# EAGLE design W033C (EAGLE 6.6.0)
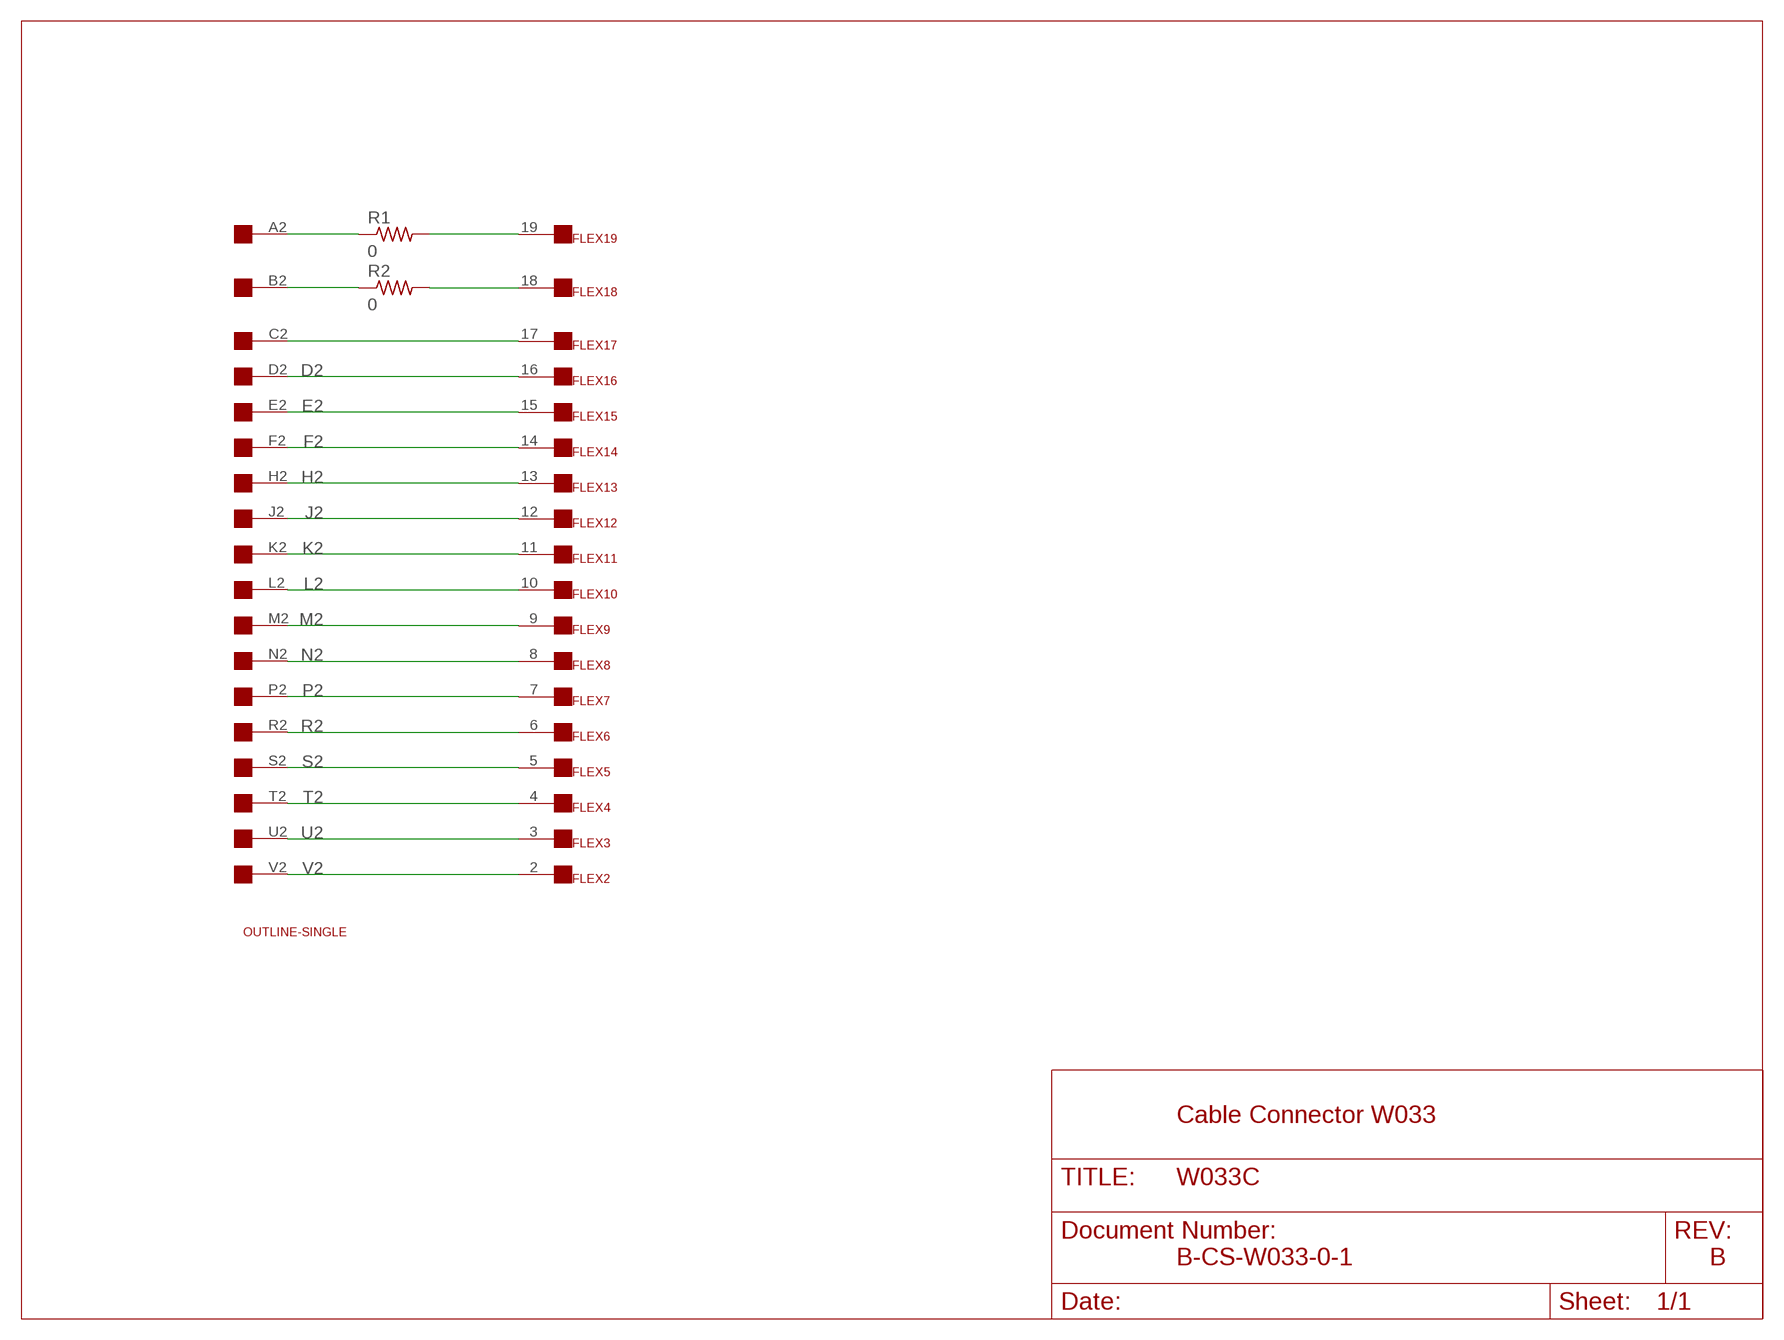
[diagram p0: schematic, sheet 1]

## Parts
FLEX  FLEX19  [FLEX19]
R1  0  R-US_0207/10  [0207/10]
R2  0  R-US_0207/10  [0207/10]
U$1  OUTLINE-SINGLE  [SINGLE]
U$2  EDGE-1  [EDGE-CON1]

## Nets
B2: R2.1 U$2.B2
D2: FLEX.16 U$2.D2
E2: FLEX.15 U$2.E2
F2: FLEX.14 U$2.F2
H2: FLEX.13 U$2.H2
J2: FLEX.12 U$2.J2
K2: FLEX.11 U$2.K2
L2: FLEX.10 U$2.L2
M2: FLEX.9 U$2.M2
N2: FLEX.8 U$2.N2
N$1: FLEX.17 U$2.C2
N$2: R1.1 U$2.A2
N$3: FLEX.19 R1.2
N$4: FLEX.18 R2.2
P2: FLEX.7 U$2.P2
R2: FLEX.6 U$2.R2
S2: FLEX.5 U$2.S2
T2: FLEX.4 U$2.T2
U2: FLEX.3 U$2.U2
V2: FLEX.2 U$2.V2
Unconnected: FLEX.1

## Notes on the sheet
- Cable Connector W033
- B-CS-W033-0-1 | B

## Library data of the parts
FLEX = dec-con:FLEX19: 19 pin Flexprint Connection
R1 R2 = rcl:R-US_: RESISTOR, American symbol
U$1 = dec-con:OUTLINE-*: Board outlines for DEC boards.
U$2 = dec-con:EDGE-1: Single-Sided DEC Edge Connector -- (side 2)

## Net classes
0 default: width 0.813 mm

## Board
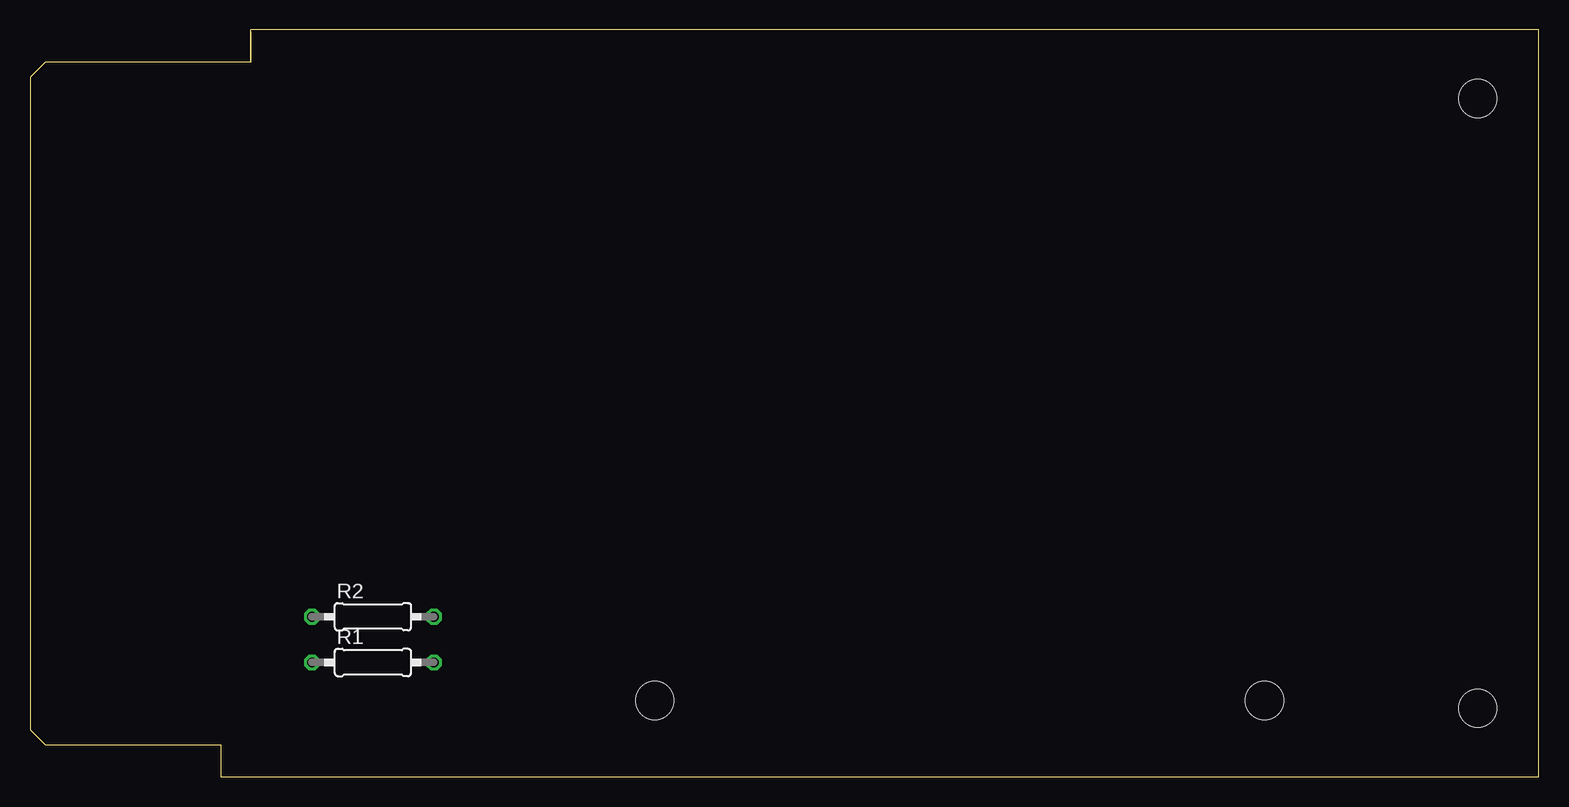
[diagram p1: board, top side]
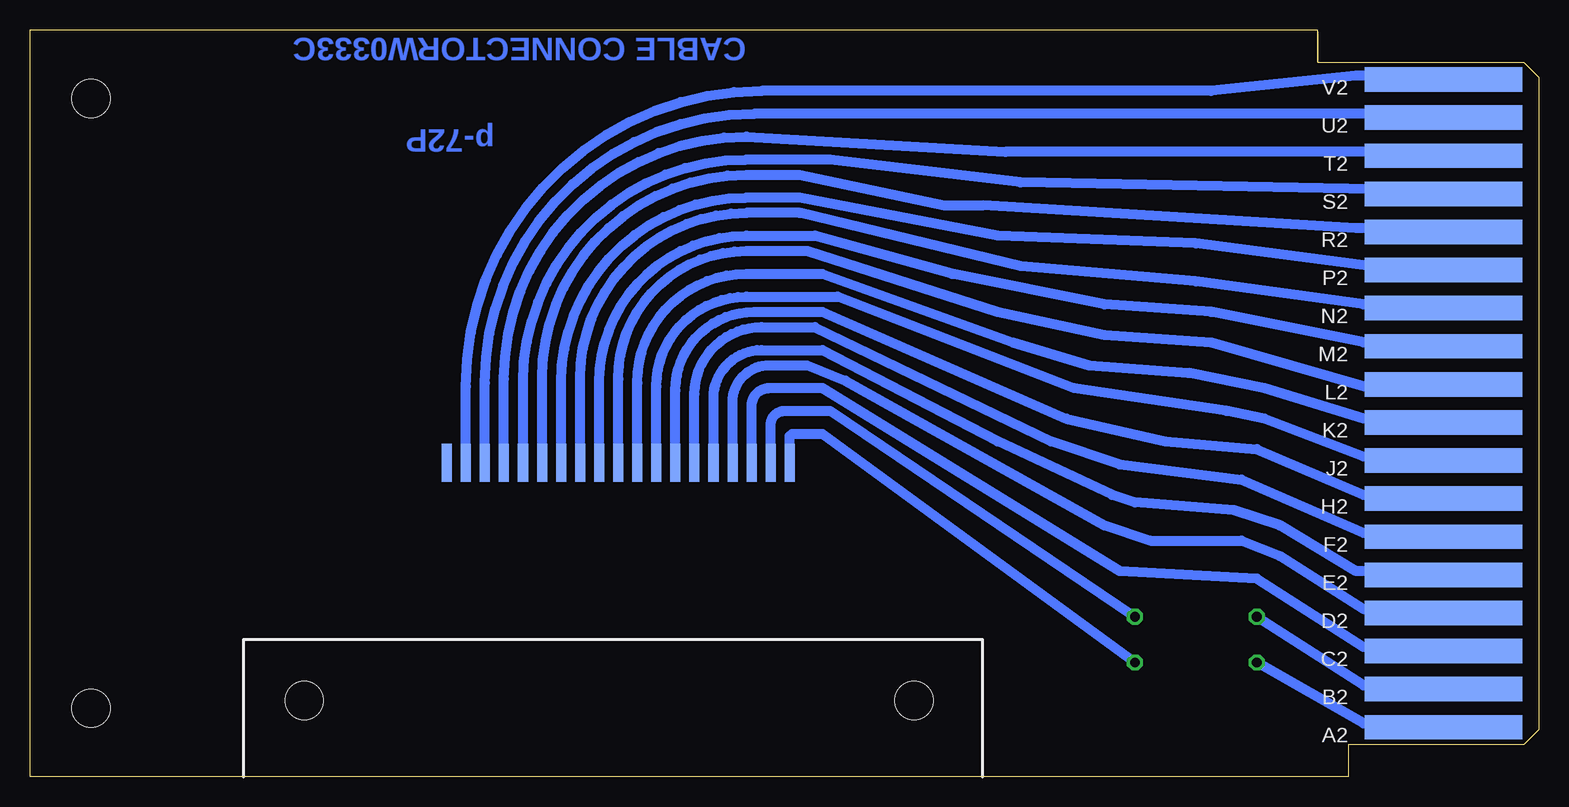
[diagram p2: board, bottom side, seen from below]

Size 125.73 x 62.23 mm. Coordinates in mm from the lower left corner, seen from the top.
Copper layers (1+16): Top 0.035mm / dielectric 1.5mm / Bottom 0.035mm
Design rules "16mils": minimum track width 16mil, minimum drill 32mil, track to track 15mil, track to pad 10mil, pad to pad 10mil, via to via 10mil, smd to smd 10mil, copper to edge 13mil, drill to drill 10mil, minimum pad ring 10mil, minimum via ring 8mil, stop-mask expansion 0mil, vias tented up to drill 0mil, thermal gap 10mil
Holes 3.17 mm at 52.07,6.35 102.87,6.35

### Footprints (pad centres in the part's own frame; a part is rotated, then mirrored left to right if it is on the bottom)
FLEX19 = smd 3.175 x 0.838: 1 0,14.287; 2 0,12.7; 3 0,11.113; 4 0,9.525; 5 0,7.938; 6 0,6.35; 7 0,4.763; 8 0,3.175; 9 0,1.587; 10 0,0; 11 0,-1.587; 12 0,-3.175; 13 0,-4.763; 14 0,-6.35; 15 0,-7.938; 16 0,-9.525; 17 0,-11.113; 18 0,-12.7; 19 0,-14.287
0207/10 = drill 0.813 octagon: 1 -5.08,0; 2 5.08,0
SINGLE = hole 3.175: 120.65,56.515; 120.65,5.715
EDGE-CON1 = smd 13.106 x 2.032 bottom: A2 7.938,4.128; B2 7.938,7.303; C2 7.938,10.477; D2 7.938,13.652; E2 7.938,16.828; F2 7.938,20.003; H2 7.938,23.177; J2 7.938,26.352; K2 7.938,29.527; L2 7.938,32.703; M2 7.938,35.877; N2 7.938,39.053; P2 7.938,42.227; R2 7.938,45.403; S2 7.938,48.578; T2 7.938,51.752; U2 7.938,54.928; V2 7.938,58.102

### Placement (x,y rotation side)
FLEX  76.71,26.16 90 bottom
R1  28.58,9.53 0 top
R2  28.58,13.34 0 top
U$1  0,0 0 top
U$2  0,0 0 top

### Tracks (layer width: path | path; a pad name or v marks a point on that pad's centre or on a via)
B2
  Bottom 0.813: U$2.B2 8.26,7.62 14.61,7.62 R2.1
D2
  Bottom 0.813: FLEX.16 67.18,31.24 arc90 64.14,34.29 60.96,34.29 57.79,33.02 36.2,20.95 32.39,19.68 24.77,19.68 21.59,18.41 14.61,13.97 8.89,13.97 U$2.D2
E2
  Bottom 0.813: FLEX.15 68.77,31.56 arc90 64.77,35.56 59.69,35.56 45.09,27.94 35.56,23.5 33.66,22.86 25.4,22.23 21.59,20.95 15.24,17.14 8.26,17.14 U$2.E2
F2
  Bottom 0.813: FLEX.14 70.36,31.88 arc90 64.77,37.47 60.33,37.47 40.64,27.94 34.93,26.04 24.77,24.77 14.61,20.32 8.89,20.32 U$2.F2
H2
  Bottom 0.813: FLEX.13 71.95,32.2 arc90 65.41,38.73 59.69,38.73 39.37,29.84 31.12,27.94 23.5,27.3 14.61,23.5 8.89,23.5 U$2.H2
J2
  Bottom 0.813: FLEX.12 73.53,32.51 arc90 66.04,40.01 58.42,40.01 38.74,32.38 26.04,30.48 22.86,29.84 14.61,26.67 8.89,26.67 U$2.J2
K2
  Bottom 0.813: FLEX.11 75.12,32.83 arc90 66.04,41.91 59.69,41.91 43.82,36.2 37.47,34.29 29.21,33.66 22.86,32.38 14.61,29.84 8.89,29.84 U$2.K2
L2
  Bottom 0.813: FLEX.10 76.71,33.15 arc90 66.04,43.81 60.96,43.81 45.09,38.73 36.2,36.83 27.31,36.2 13.97,32.38 8.89,32.38 U$2.L2
M2
  Bottom 0.813: FLEX.9 78.3,32.83 arc90 66.04,45.09 60.33,45.09 48.9,41.91 36.2,39.37 27.31,38.73 14.61,36.2 8.26,36.2 U$2.M2
N2
  Bottom 0.813: FLEX.8 79.88,33.15 arc90 66.04,46.99 61.6,46.99 43.18,42.55 28.58,41.27 14.61,39.37 8.89,39.37 U$2.N2
N$1
  Bottom 0.813: U$2.C2 8.26,10.79 14.61,10.79 23.5,16.51 34.93,17.14 59.69,32.38 64.14,32.38 arc-90 65.6,30.93 FLEX.17
N$2
  Bottom 0.813: U$2.A2 7.62,4.45 14.61,4.45 R1.1
N$3
  Bottom 0.813: FLEX.19 62.42,28.39 62.23,28.57 59.69,28.57 R1.2
N$4
  Bottom 0.813: R2.2 59.06,30.48 62.87,30.48 arc-90 64.01,29.34 FLEX.18
P2
  Bottom 0.813: U$2.P2 9.21,42.23 9.53,42.55 13.97,42.55 28.58,44.45 45.09,45.09 61.6,48.26 66.04,48.26 arc-90 81.47,32.83 FLEX.7
R2
  Bottom 0.813: U$2.R2 8.57,45.4 8.89,45.72 15.24,45.72 46.36,47.62 49.53,47.62 61.6,50.16 66.04,50.16 arc-90 83.06,33.15 FLEX.6
S2
  Bottom 0.813: U$2.S2 9.21,48.58 9.53,48.9 43.18,49.53 59.06,51.44 66.04,51.44 arc-90 84.65,32.83 FLEX.5
T2
  Bottom 0.813: U$2.T2 8.26,52.07 44.45,52.07 66.04,53.34 arc-90 86.23,33.15 FLEX.4
U2
  Bottom 0.813: U$2.U2 8.26,55.24 65.41,55.24 arc-90 87.82,32.83 FLEX.3
V2
  Bottom 0.813: U$2.V2 8.26,58.1 8.89,58.42 15.24,58.42 27.31,57.15 64.77,57.15 arc-90 89.41,32.51 FLEX.2

### Text on the board
Bottom: CABLE CONNECTOR | W0333C | p-72P
200bmp: C:/Users/Vince/Documents/eagle/projects/DEC/Wxxx/W033/W033Cbackfb.bmp